# Altium schematic sheet DRAFT_Alimentation.SchDoc
size A4; Date: 13/04/2026; Author: P. Fischer; DrawnBy: P. Fischer; SheetNumber: 1; SheetTotal: 1
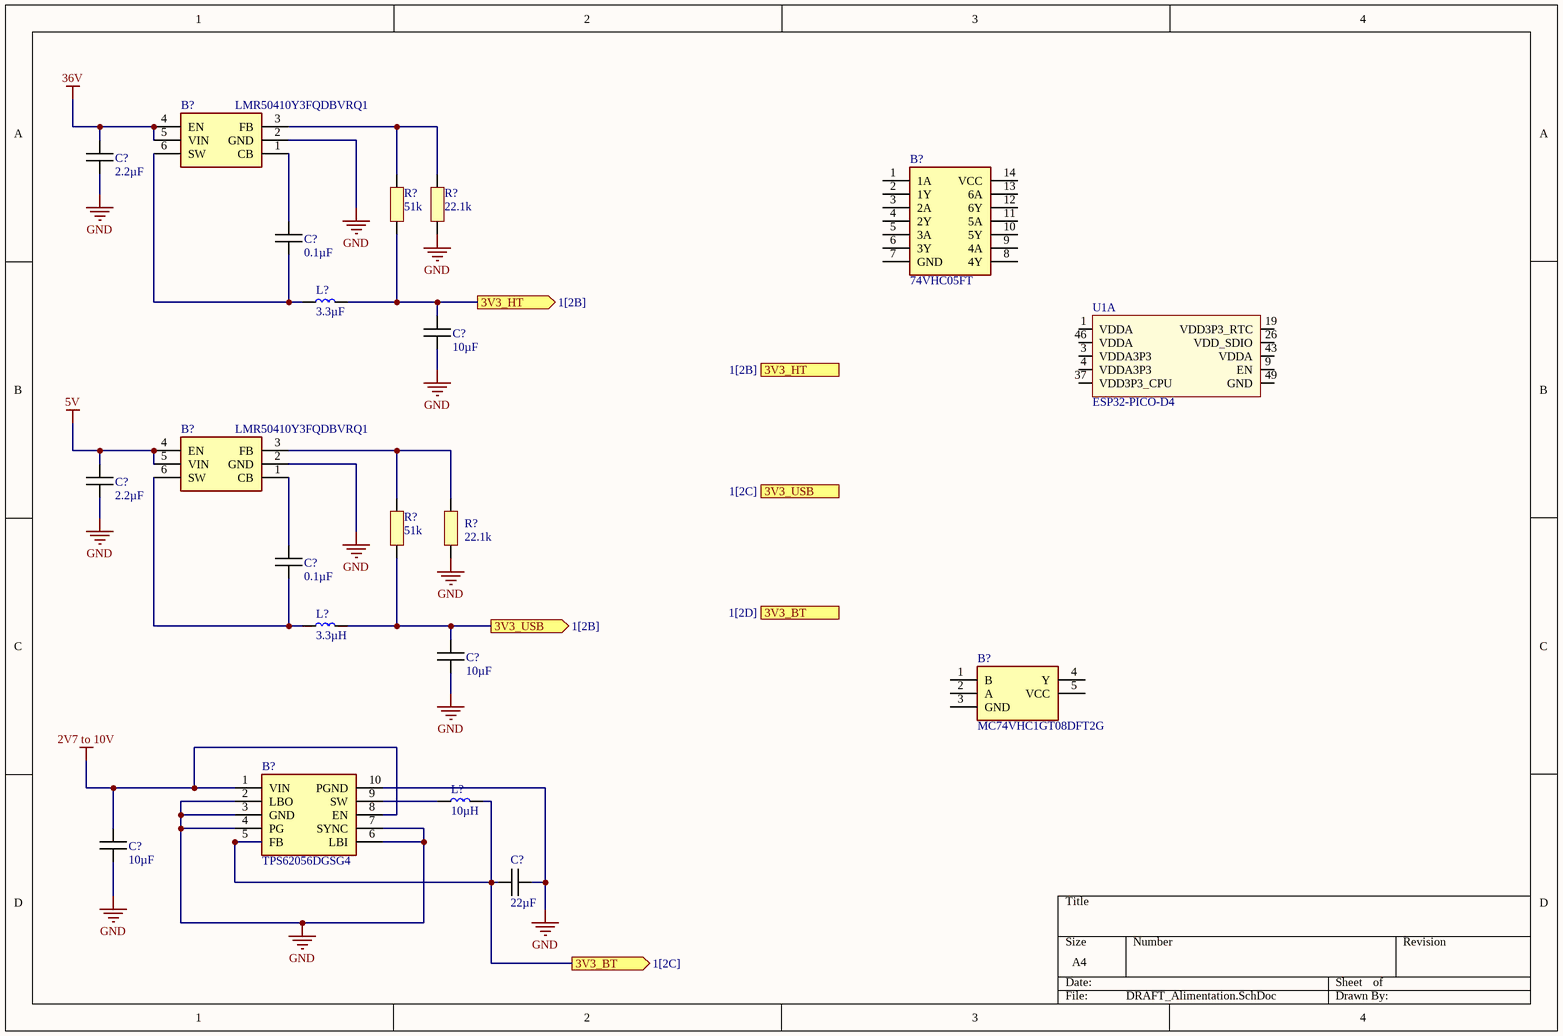
[diagram p0: DRAFT_Alimentation.SchDoc]

## Parts
(Parts that share a designator on the sheet are numbered #1, #2 ... from top to bottom, then left to right.)
B?#1  LMR50410Y3FQDBVRQ1  [SOT95P280X145-6N]
B?#2  74VHC05FT  [SOP65P640X120-14N]
B?#3  LMR50410Y3FQDBVRQ1  [SOT95P280X145-6N]
B?#4  MC74VHC1GT08DFT2G  [SOT65P210X110-5N]
B?#5  TPS62056DGSG4  [SOP50P490X110-10N]
C?#1  2.2µF  [CAPC1005X06N]
C?#2  0.1µF  [CAPC1005X06N]
C?#3  10µF  [CAPC1005X06N]
C?#4  2.2µF  [CAPC1005X06N]
C?#5  0.1µF  [CAPC1005X06N]
C?#6  10µF  [CAPC1005X06N]
C?#7  10µF  [CAPC1005X06N]
C?#8  22µF  [CAPC1005X06N]
L?#1  3.3µF  [LQPC1005X06N]
L?#2  3.3µH  [LQPC1005X06N]
L?#3  10µH  [LQPC1005X06N]
R?#1  51k  [RESC1005X06N]
R?#2  22.1k  [RESC1005X06N]
R?#3  51k  [RESC1005X06N]
R?#4  22.1k  [RESC1005X06N]
U1  ESP32-PICO-D4  [PQFN50P700X700X104_HS-49N]  (part A of 3)

## Ports
3V3_BT (out, see 1[2C]), 3V3_BT (out, see 1[2D]), 3V3_HT (in, see 1[2B]), 3V3_HT (out, see 1[2B]), 3V3_USB (out, see 1[2B]), 3V3_USB (out, see 1[2C])

## Nets
2V7 to 10V: B?#5.1(VIN) B?#5.8(EN) C?#7.1
5V: B?#3.4(EN) B?#3.5(VIN) C?#4.1
36V: B?#1.4(EN) B?#1.5(VIN) C?#1.1
GND: B?#1.2(GND) B?#3.2(GND) B?#5.2(LBO) B?#5.3(GND) B?#5.4(PG) B?#5.6(LBI) B?#5.7(SYNC) B?#5.10(PGND) C?#1.2 C?#3.2 C?#4.2 C?#6.2 C?#7.2 C?#8.2 R?#2.1 R?#4.1
3V3_BT: B?#5.5(FB) C?#8.1 L?#3.2 ; port 3V3_BT
3V3_HT: C?#3.1 L?#1.2 R?#1.1 ; port 3V3_HT
3V3_USB: C?#6.1 L?#2.2 R?#3.1 ; port 3V3_USB
NetB?#1_1: B?#1.1(CB) C?#2.1
NetB?#1_3: B?#1.3(FB) R?#1.2 R?#2.2
NetB?#1_6: B?#1.6(SW) C?#2.2 L?#1.1
NetB?#3_1: B?#3.1(CB) C?#5.1
NetB?#3_3: B?#3.3(FB) R?#3.2 R?#4.2
NetB?#3_6: B?#3.6(SW) C?#5.2 L?#2.1
NetB?#5_9: B?#5.9(SW) L?#3.1

Not connected (* = marked no-connect by the designer): B?#2 1(1A) 2(1Y) 3(2A) 4(2Y) 5(3A) 6(3Y) 7(GND) 8(4Y) 9(4A) 10(5Y) 11(5A) 12(6Y) 13(6A) 14(VCC); B?#4 1(B) 2(A) 3(GND) 4(Y) 5(VCC); U1 1(VDDA) 3(VDDA3P3) 4(VDDA3P3) 9(EN) 19(VDD3P3_RTC) 26(VDD_SDIO) 37(VDD3P3_CPU) 43(VDDA) 46(VDDA) 49(GND)

## Library data of the parts
B?#1 B?#3 = LMR50410Y3FQDBVRQ1: Régulateurs de tension de commutation Automotive qualified SIMPLE SWITCHER 4-V to 36-V, 1-A synchronous step-down converter 6-SOT-23 -40 to 150; Manufacturer_Name: Texas Instruments; Manufacturer_Part_Number: LMR50410Y3FQDBVRQ1; Mouser Part Number: 595-R50410Y3FQDBVRQ1
B?#2 = 74VHC05FT: Logic Gates CMOS LOGIC IC INVERTER; Manufacturer_Name: Toshiba; Manufacturer_Part_Number: 74VHC05FT; Mouser Part Number: 757-74VHC05FT
B?#4 = MC74VHC1GT08DFT2G: Single 2-Input AND Gate, TTL Level; Manufacturer_Name: onsemi; Manufacturer_Part_Number: MC74VHC1GT08DFT2G; Parameter 3: *
B?#5 = TPS62056DGSG4: TEXAS INSTRUMENTS - TPS62056DGSG4 - Synchronous Buck (Step Down) Switching Regulator, Fixed, 2.7V-10Vin, 3.3V/0.8A out, 850kHz, VSSOP-10; Manufacturer_Name: Texas Instruments; Manufacturer_Part_Number: TPS62056DGSG4; Mouser Part Number: 595-TPS62056DGSG4
C?#1-C?#8 = Capacitor
L?#1-L?#3 = Bobine
R?#1-R?#4 = Resistor
U1 = ESP32: Système RF sur puce - SoC SIP module ESP32 with 4MByte Flash, Dual Core MCU, Wi-Fi & Bluetooth Combo, LGA48-pin, 7*7mm; Manufacturer 1: Espressif Systems; Supplier 1: Digi-Key; Supplier Part Number 1: 1904-1029-1-ND; Manufacturer Part Number 1: ESP32-PICO-D4